# Altium schematic sheet Fri3d_2026_DJ_01.SchDoc: DJ Add-On
size A3; Date: 27/02/2026; DrawnBy: Wim Van Gool; DocumentNumber: 1; Revision: 01; SheetNumber: 1; SheetTotal: 1
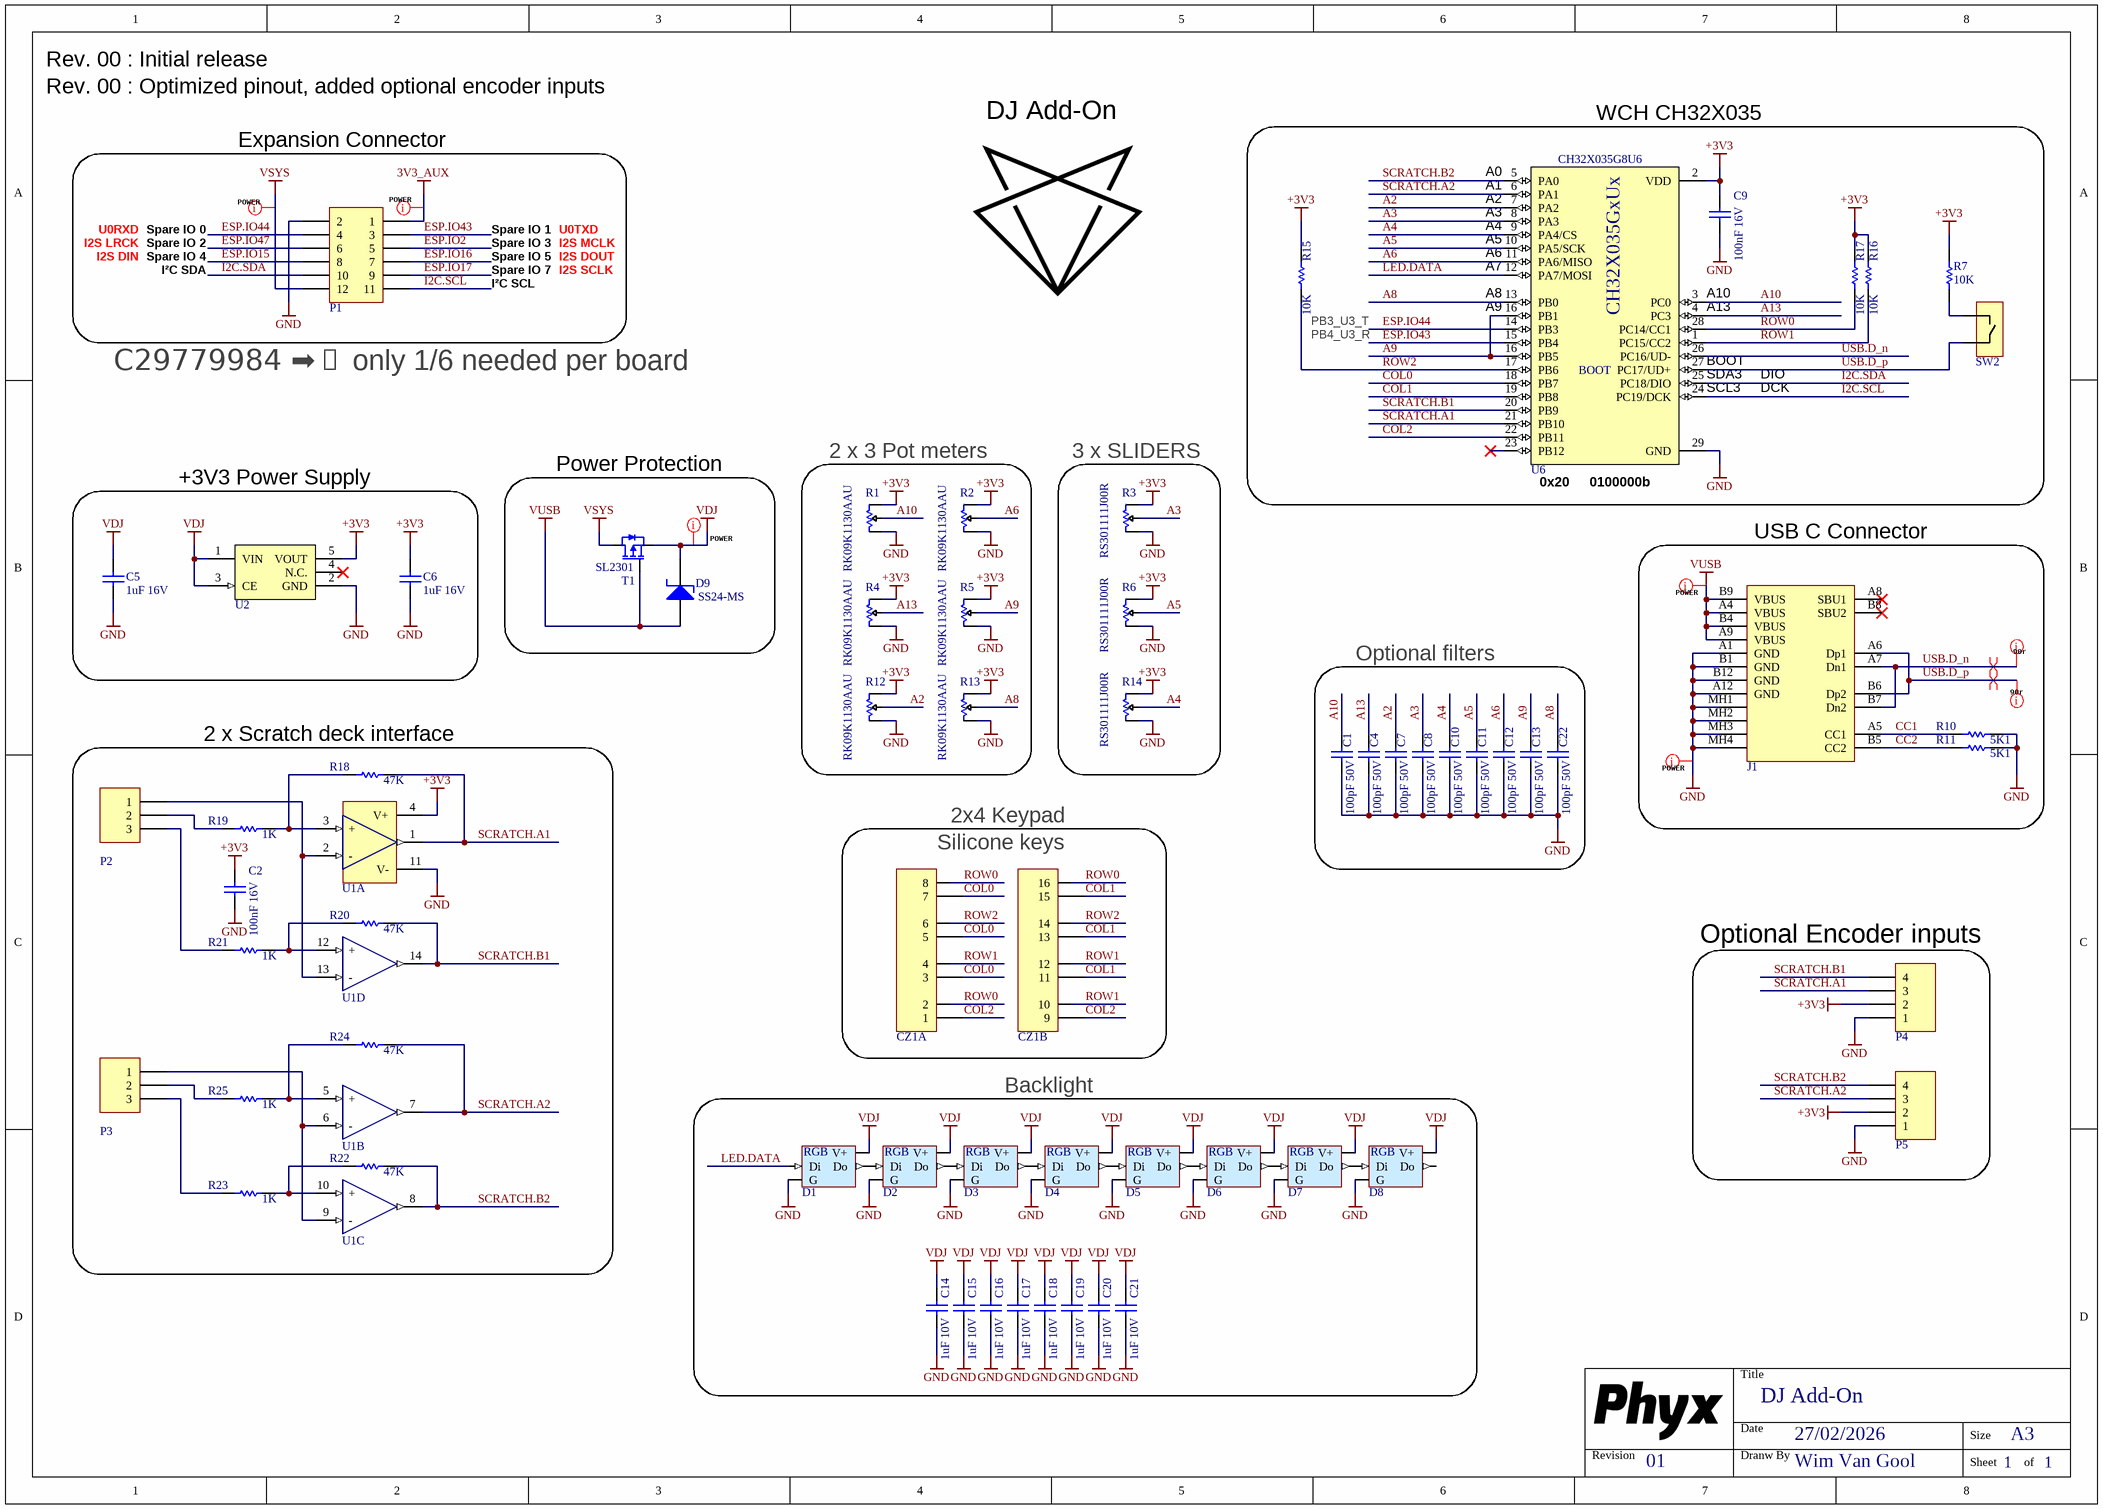
[diagram p0: Fri3d_2026_DJ_01.SchDoc]

## Parts
C1  value 100pF 50V  [C0603_N]
C2  value 100nF 16V  [C0603_N]
C4  value 100pF 50V  [C0603_N]
C5  value 1uF 16V  [C0603_N]
C6  value 1uF 16V  [C0603_N]
C7  value 100pF 50V  [C0603_N]
C8  value 100pF 50V  [C0603_N]
C9  value 100nF 16V  [C0603_N]
C10  value 100pF 50V  [C0603_N]
C11  value 100pF 50V  [C0603_N]
C12  value 100pF 50V  [C0603_N]
C13  value 100pF 50V  [C0603_N]
C14  value 1uF 10V  [C0402]
C15  value 1uF 10V  [C0402]
C16  value 1uF 10V  [C0402]
C17  value 1uF 10V  [C0402]
C18  value 1uF 10V  [C0402]
C19  value 1uF 10V  [C0402]
C20  value 1uF 10V  [C0402]
C21  value 1uF 10V  [C0402]
C22  value 100pF 50V  [C0603_N]
CZ1  Campzone 2020 2x4 silicone keypad  [CZ20_2x4]  (value not drawn)  (parts A,B of 2)
D1  WS2812 based digital RGB LED 5050 White package reduced current  [LED_5050_WS2812B_WHITE]  (value not drawn)
D2  WS2812 based digital RGB LED 5050 White package reduced current  [LED_5050_WS2812B_WHITE]  (value not drawn)
D3  WS2812 based digital RGB LED 5050 White package reduced current  [LED_5050_WS2812B_WHITE]  (value not drawn)
D4  WS2812 based digital RGB LED 5050 White package reduced current  [LED_5050_WS2812B_WHITE]  (value not drawn)
D5  WS2812 based digital RGB LED 5050 White package reduced current  [LED_5050_WS2812B_WHITE]  (value not drawn)
D6  WS2812 based digital RGB LED 5050 White package reduced current  [LED_5050_WS2812B_WHITE]  (value not drawn)
D7  WS2812 based digital RGB LED 5050 White package reduced current  [LED_5050_WS2812B_WHITE]  (value not drawn)
D8  WS2812 based digital RGB LED 5050 White package reduced current  [LED_5050_WS2812B_WHITE]  (value not drawn)
D9  value SS24-MS  [DO-214AC_AC]  (hidden comment: 40V 2A 550mV@2A DO-214 Schottky)
J1  USB 2.0 C Reversible Receptacle Horizontal full SMD  [XUNPU-TYPEC-304S-ACP16]  (value not drawn)
P1  Header 6X2  [HDR2X6]  (value not drawn)
P2  Header 3  [HDR1X3]  (value not drawn)
P3  Header 3  [HDR1X3]  (value not drawn)
P4  Header 1.0mm RA Shrouded 4  [WE_665104131822]  (value not drawn)
P5  Header 1.0mm RA Shrouded 4  [WE_665104131822]  (value not drawn)
R1  value RK09K1130AAU  [ALPS_RK09K1130AAU]  (hidden comment: 10kΩ Rotary Potentiometers)
R2  value RK09K1130AAU  [ALPS_RK09K1130AAU]  (hidden comment: 10kΩ Rotary Potentiometers)
R3  value RS301111J00R  [ALPS_RS301111J00R]  (hidden comment: 50kΩ Slide Potentiometers)
R4  value RK09K1130AAU  [ALPS_RK09K1130AAU]  (hidden comment: 10kΩ Rotary Potentiometers)
R5  value RK09K1130AAU  [ALPS_RK09K1130AAU]  (hidden comment: 10kΩ Rotary Potentiometers)
R6  value RS301111J00R  [ALPS_RS301111J00R]  (hidden comment: 50kΩ Slide Potentiometers)
R7  value 10K  [R0603_N]
R10  value 5K1  [R0603_N]
R11  value 5K1  [R0603_N]
R12  value RK09K1130AAU  [ALPS_RK09K1130AAU]  (hidden comment: 10kΩ Rotary Potentiometers)
R13  value RK09K1130AAU  [ALPS_RK09K1130AAU]  (hidden comment: 10kΩ Rotary Potentiometers)
R14  value RS301111J00R  [ALPS_RS301111J00R]  (hidden comment: 50kΩ Slide Potentiometers)
R15  value 10K  [R0603_N]
R16  value 10K  [R0603_N]
R17  value 10K  [R0603_N]
R18  value 47K  [R0603_N]  (hidden comment: RESISTOR)
R19  value 1K  [R0603_N]
R20  value 47K  [R0603_N]  (hidden comment: RESISTOR)
R21  value 1K  [R0603_N]
R22  value 47K  [R0603_N]  (hidden comment: RESISTOR)
R23  value 1K  [R0603_N]
R24  value 47K  [R0603_N]  (hidden comment: RESISTOR)
R25  value 1K  [R0603_N]
SW2  4.5x4.5mm tact SMD H3,8mm  [WE_430181038816]  (value not drawn)
T1  value SL2301  [SOT23-3]  (hidden comment: -2.3A -20V P-Ch MOSFET Vgs -1V)
U1  Quad, 30-V, 1-MHz operational amplifier  [SOIC_N_14]  (value not drawn)  (parts A,B,C,D of 4)
U2  3V3 LDO 300mA 150mV  [SOT23-5]  (value not drawn)
U6  value CH32X035G8U6  [QFN_28_4.0x4.0_P0.4]  (hidden comment: WCH CH32X035G8U6 QFN28 RISC-V 32-bit MCU, 62KB Flash, 10KB RAM, USB PD)

## Blocks framed on the sheet
WCH CH32X035: C9 R7 R15-R17 SW2 U6
C29779984 ➡️ only 1/6 needed per board: P1
+3V3 Power Supply: C5 C6 U2
Power Protection: D9 T1
USB C Connector: J1 R10 R11
2 x Scratch deck interface: C2 P2 P3 R18-R25 U1
Silicone keys: CZ1
Optional Encoder inputs: P4 P5

## Nets
3V3_AUX: P1.1
+3V3: C2.1 C6.1 C9.1 P4.2 P5.2 R1.1 R2.1 R3.1 R4.1 R5.1 R6.1 R7.1 R12.1 R13.1 R14.1 R15.1 R16.1 R17.1 U1.4(V+) U2.5(VOUT) U6.2(VDD)
GND: C1.2 C2.2 C4.2 C5.2 C6.2 C7.2 C8.2 C9.2 C10.2 C11.2 C12.2 C13.2 C14.2 C15.2 C16.2 C17.2 C18.2 C19.2 C20.2 C21.2 C22.2 D1.3(G) D2.3(G) D3.3(G) D4.3(G) D5.3(G) D6.3(G) D7.3(G) D8.3(G) J1.A1(GND) J1.A12(GND) J1.B1(GND) J1.B12(GND) J1.MH1(Tab) J1.MH2(Tab) J1.MH3(Tab) J1.MH4(Tab) P1.2 P4.1 P5.1 R1.3 R2.3 R3.3 R4.3 R5.3 R6.3 R10.2 R11.2 R12.3 R13.3 R14.3 U1.11(V-) U2.2(GND) U6.29(GND)
VDJ: C5.1 C14.1 C15.1 C16.1 C17.1 C18.1 C19.1 C20.1 C21.1 D1.1(V+) D2.1(V+) D3.1(V+) D4.1(V+) D5.1(V+) D6.1(V+) D7.1(V+) D8.1(V+) D9.C T1.2(S) U2.1(VIN) U2.3(CE)
VSYS: P1.12 T1.3(D)
VUSB: D9.A J1.A4(VBUS) J1.A9(VBUS) J1.B4(VBUS) J1.B9(VBUS) T1.1(G)
A2: C7.1 R12.2 U6.7(PA2)
A3: C8.1 R3.2 U6.8(PA3)
A4: C10.1 R14.2 U6.9(PA4/CS)
A5: C11.1 R6.2 U6.10(PA5/SCK)
A6: C12.1 R2.2 U6.11(PA6/MISO)
A8: C22.1 R13.2 U6.13(PB0)
A9: C13.1 R5.2 U6.16(PB1)
A10: C1.1 R1.2 U6.3(PC0)
A13: C4.1 R4.2 U6.4(PC3)
CC1: J1.A5(CC1) R10.1
CC2: J1.B5(CC2) R11.1
COL0: CZ1.3 CZ1.5 CZ1.7 U6.18(PB7)
COL1: CZ1.11 CZ1.13 CZ1.15 U6.19(PB8)
COL2: CZ1.1 CZ1.9 U6.22(PB11)
ESP.IO2: P1.5
ESP.IO15: P1.8
ESP.IO16: P1.7
ESP.IO17: P1.9
ESP.IO43: P1.3 U6.15(PB4)
ESP.IO44: P1.4 U6.14(PB3)
ESP.IO47: P1.6
I2C.SCL: P1.11 U6.24(PC19/DCK)
I2C.SDA: P1.10 U6.25(PC18/DIO)
LED.DATA: D1.4(Di) U6.12(PA7/MOSI)
ROW0: CZ1.2 CZ1.8 CZ1.16 R17.2 U6.28(PC14/CC1)
ROW1: CZ1.4 CZ1.10 CZ1.12 R16.2 U6.1(PC15/CC2)
ROW2: CZ1.6 CZ1.14 R15.2 U6.17(PB6)
SCRATCH.A1: P4.3 R18.1 U1.1(OUT) U6.21(PB10)
SCRATCH.A2: P5.3 R24.1 U1.7(OUT) U6.6(PA1)
SCRATCH.B1: P4.4 R20.1 U1.14(OUT) U6.20(PB9)
SCRATCH.B2: P5.4 R22.1 U1.8(OUT) U6.5(PA0)
USB.D_n: J1.A7(Dn1) J1.B7(Dn2) U6.26(PC16/UD-)
USB.D_p: J1.A6(Dp1) J1.B6(Dp2) SW2.2 U6.27(PC17/UD+)
NetD1_2: D1.2(Do) D2.4(Di)
NetD2_2: D2.2(Do) D3.4(Di)
NetD3_2: D3.2(Do) D4.4(Di)
NetD4_2: D4.2(Do) D5.4(Di)
NetD5_2: D5.2(Do) D6.4(Di)
NetD6_2: D6.2(Do) D7.4(Di)
NetD7_2: D7.2(Do) D8.4(Di)
NetP2_1: P2.1 U1.2(-) U1.13(-)
NetP2_2: P2.2 R19.2
NetP2_3: P2.3 R21.2
NetP3_1: P3.1 U1.6(-) U1.9(-)
NetP3_2: P3.2 R25.2
NetP3_3: P3.3 R23.2
NetR7_2: R7.2 SW2.1
NetR18_2: R18.2 R19.1 U1.3(+)
NetR20_2: R20.2 R21.1 U1.12(+)
NetR22_2: R22.2 R23.1 U1.10(+)
NetR24_2: R24.2 R25.1 U1.5(+)

Not connected (* = marked no-connect by the designer): D8 2(Do); J1 A8(SBU1)* B8(SBU2)*; U2 4(N.C.)*; U6 23(PB12)*

## Layout directives
net class 90r: USB.D_n, USB.D_p
differential pair: USB.D_n, USB.D_p
net class POWER: 3V3_AUX, GND, VDJ, VSYS, VUSB

## Notes on the sheet
- Rev. 00 : Initial release
- Rev. 00 : Optimized pinout, added optional encoder inputs
- Expansion Connector
- (near U6) A0
- I2S LRCK
- I2S DIN
- U0RXD
- Spare IO 0
- Spare IO 2
- Spare IO 4
- Spare IO 1
- Spare IO 3
- Spare IO 5
- I2S MCLK
- I2S DOUT
- U0TXD
- (near U6) A1
- (near U6) A2
- (near U6) A3
- (near U6) A4
- (near U6) A5
- I²C SDA
- I²C SCL
- Spare IO 7
- I2S SCLK
- (near U6) A6
- (near U6) A7
- (near U6) A8
- (near U6) A9
- (near U6) A10
- (near U6) A13
- (near R15) PB3_U3_T
- (near R15) PB4_U3_R
- (near U6) BOOT
- (near U6) SDA3
- DIO
- 2 x 3 Pot meters
- (near R3) 3 x SLIDERS
- (near U6) SCL3
- DCK
- (near U6) 0x20
- (near U6) 0100000b
- Optional filters
- 2x4 Keypad
- Backlight
- Title
- Revision
- Date
- Dranw By
- Size
- Sheet
- of
- (in symbol LED # RGB WS2812C-5050 WH) RGB
- (in symbol RISCV # CH32X035G8U6) CH32X035GxUx; BOOT

## Library data of the parts
C1 C4 C7 C8 C10-C13 C22 = CAP # 100pF 50V 0603: Capacitor Ceramic; Supplier 1: LCSC; Supplier 2: LCSC; Supplier 3: Generic; Supplier Part Number 1: C344186; Supplier Part Number 2: C14665; Supplier Part Number 3: 100pF 50V 0603
C2 C9 = CAP # 100nF 16V 0603: Capacitor Ceramic; Supplier 1: LCSC; Supplier 3: Generic; Supplier Part Number 1: C282519; Supplier Part Number 3: 100nF 16V 0603 X7R
C5 C6 = CAP # 1uF 16V 0603: Capacitor Ceramic; Supplier 1: Farnell; Supplier Part Number 1: 2320814; Supplier 3: Generic; Supplier Part Number 3: 1uF 16V 0603 X7R; Supplier 2: LCSC; Supplier Part Number 2: C1592
C14-C21 = CAP # 1uF 10V 0402: Capacitor Ceramic; Supplier 1: LCSC; Supplier Part Number 1: C380293; Supplier 3: Generic; Supplier Part Number 3: 1uF 10V 0402 X5R
CZ1 = SW # CZ20 2x4: Value: CZ20 2x4; Supplier 1: STOCK
D1-D8 = LED # RGB WS2812C-5050 WH: =Description; Value: WS218C 5050 WH; Supplier 1: Aliexpress; Supplier Part Number 1: WS2812C Black 5050; Supplier 2: LCSC; Supplier Part Number 2: C114587
D9 = Schottky # SS24-MS: =Description; Supplier 1: LCSC; Supplier Part Number 1: C2836395
J1 = USB # C 2.0 RCPT TYPEC-304S-ACP16: Value: TYPEC-304S-ACP16; Supplier 1: LCSC; Supplier Part Number 1: C5187472; Supplier 2: LCSC; Supplier 3: LCSC; Supplier Part Number 2: C2927040; Supplier Part Number 3: C5156603
P1 = Pin Header 2.54mm dual row 12way
P2 P3 = Pin Header 2.54mm 3way: Supplier 1: LCSC; Supplier Part Number 1: C429954; Supplier 2: LCSC; Supplier Part Number 2: C49257
P4 P5 = HDR # RA SHR 1.0mm 4way - 665104131822: Value: 665104131822; Supplier 1: Wurth; Supplier Part Number 1: 665104131822; Supplier 2: Mouser; Supplier Part Number 2: 710-665104131822; Supplier 3: LCSC; Supplier Part Number 3: C2905006
R1 R2 R4 R5 R12 R13 = RES VAR POT 10k RK09K1130AAU: Supplier 1: LCSC; Supplier Part Number 1: C202373; Supplier 2: Mouser; Supplier Part Number 2: 688-RK09K1130AAU
R3 R6 R14 = RES VAR SLIDE 50k RS301111J00R: Supplier 1: LCSC; Supplier Part Number 1: C361172
R7 R15-R17 = RES # 10K 0603: Supplier 3: Generic; Supplier Part Number 3: 10K 1% 0603; Supplier 1: Farnell; Supplier Part Number 1: 2502397; Supplier 2: LCSC; Supplier Part Number 2: C25804
R10 R11 = RES # 5K1 0603: Supplier 1: Farnell; Supplier Part Number 1: 2845922; Supplier 2: LCSC; Supplier 3: Generic; Supplier Part Number 2: C112314; Supplier Part Number 3: 5K1 1% 0603
R18 R20 R22 R24 = RES # 47K 0603: Supplier 1: LCSC; Supplier Part Number 1: C2907042; Supplier 2: LCSC; Supplier Part Number 2: C146207; Supplier 3: Generic; Supplier Part Number 3: 47K 1% 0603
R19 R21 R23 R25 = RES # 1K 0603: Supplier 1: Farnell; Supplier Part Number 1: 2689409; Supplier 2: LCSC; Supplier Part Number 2: C21190; Supplier 3: Generic; Supplier Part Number 3: 1K 1% 0603
SW2 = SW # TACT small 4.5x4.5mm SMD WS-TASV: Value: 430181038816; Supplier 1: Wurth; Supplier Part Number 1: 430181038816; Supplier 2: Mouser; Supplier Part Number 2: 710-430181038816; Supplier 3: LCSC; Supplier Part Number 3: C174049
T1 = SL2301 P-Ch MOSFET -2.3A -20Vds: =Description; Supplier 1: LCSC; Supplier Part Number 1: C181086
U1 = OP # LM324: =Description; Value: LM324; Supplier 1: LCSC; Supplier Part Number 1: C2977086; Supplier 2: LCSC; Supplier Part Number 2: C7432021; Supplier 3: LCSC; Supplier Part Number 3: C19723736
U2 = LDO # 3V3 300mA RT9078-33GJ5: =Designator; Value: RT9078-33GJ5; Supplier 1: LCSC; Supplier Part Number 1: C110427
U6 = RISCV # CH32X035G8U6: Supplier 1: LCSC; Supplier Part Number 1: C7437027